# EAGLE schematic schematic (EAGLE 9.6.2)
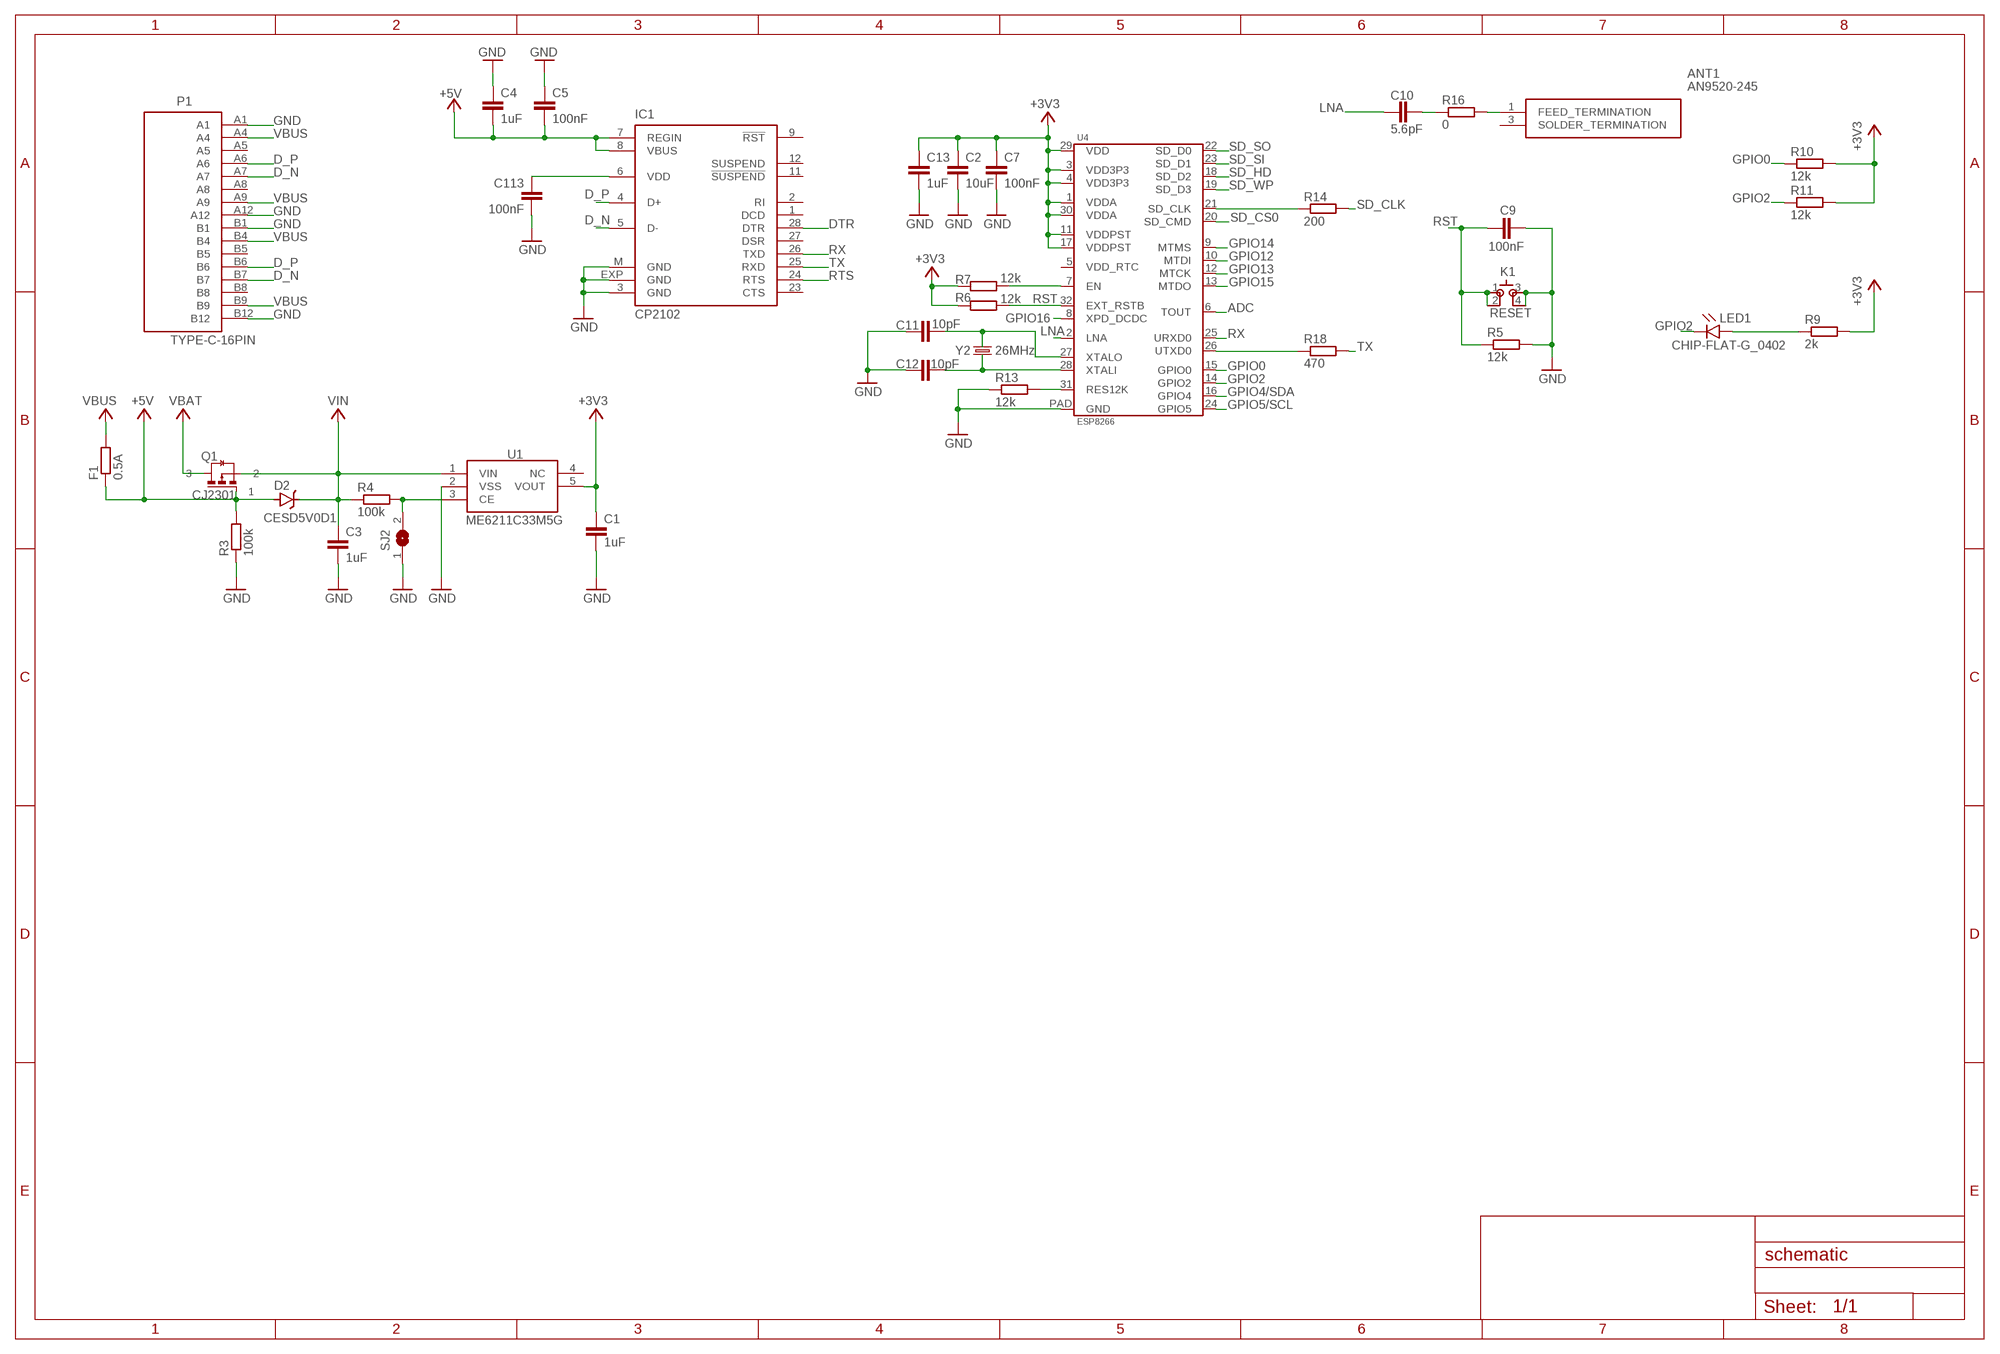
[diagram p0: schematic, sheet 1]

## Parts
ANT1  AN9520-245  [AN9520245]
C1  1uF  C-EUC0402  [C0402]
C2  10uF  C-EUC0402  [C0402]
C3  1uF  C-EUC0402  [C0402]
C4  1uF  C-EUC0402  [C0402]
C5  100nF  C-EUC0402  [C0402]
C7  100nF  C-EUC0402  [C0402]
C9  100nF  C-EUC0402  [C0402]
C10  5.6pF  C-EUC0402  [C0402]
C11  10pF  C-EUC0402  [C0402]
C12  10pF  C-EUC0402  [C0402]
C13  1uF  C-EUC0402  [C0402]
C113  100nF  C-EUC0402  [C0402]
D2  CESD5V0D1  [SOD-123]
F1  0.5A  R-EU_R0402  [R0402]
IC1  CP2102  [MLP28]
K1  RESET  SKSCLDE010  [SKSCLDE010]
LED1  CHIP-FLAT-G_0402  [LEDC1005X25N_FLAT-G]
P1  TYPE-C-16PIN  [TYPE-C-16PIN]
Q1  CJ2301  [SOT95P240X115-3N]
R3  100k  R-EU_R0402  [R0402]
R4  100k  R-EU_R0402  [R0402]
R5  12k  R-EU_R0402  [R0402]
R6  12k  R-EU_R0402  [R0402]
R7  12k  R-EU_R0402  [R0402]
R9  2k  R-EU_R0402  [R0402]
R10  12k  R-EU_R0402  [R0402]
R11  12k  R-EU_R0402  [R0402]
R13  12k  R-EU_R0402  [R0402]
R14  200  R-EU_R0402  [R0402]
R16  0  R-EU_R0603  [R0603]
R18  470  R-EU_R0402  [R0402]
SJ2  SJ  [SJ]
U1  ME6211C33M5G  [SOT95P282X145-5N]
U4  ESP8266  [ESP8266]
Y2  26MHz  YSX321SL  [SMD-3225-4]

## Nets
+3V3: C1.1 C2.1 C7.1 C13.1 R6.1 R7.1 R9.2 R10.2 R11.2 U1.5(VOUT) U4.1(VDDA) U4.3(VDD3P3) U4.4(VDD3P3) U4.11(VDDPST) U4.17(VDDPST) U4.29(VDD) U4.30(VDDA)
+5V: C4.2 C5.2 D2.A F1.1 IC1.7(REGIN) IC1.8(VBUS) Q1.1 R3.2
ADC: U4.6(TOUT)
D_N: IC1.5(D-) P1.A7 P1.B7
D_P: IC1.4(D+) P1.A6 P1.B6
DTR: IC1.28(DTR)
EN: R4.2 SJ2.2 U1.3(CE)
GND: C1.2 C2.2 C3.2 C4.1 C5.1 C7.2 C9.2 C11.1 C12.1 C13.2 C113.2 IC1.3(GND) IC1.EXP(GND) IC1.M(GND) K1.3 K1.4 P1.A1 P1.A12 P1.B1 P1.B12 R3.1 R5.2 R13.1 SJ2.1 U1.2(VSS) U4.PAD(GND)
GPIO0: R10.1 U4.15(GPIO0)
GPIO2: LED1.C R11.1 U4.14(GPIO2)
GPIO4/SDA: U4.16(GPIO4)
GPIO5/SCL: U4.24(GPIO5)
GPIO12: U4.10(MTDI)
GPIO13: U4.12(MTCK)
GPIO14: U4.9(MTMS)
GPIO15: U4.13(MTDO)
GPIO16: U4.8(XPD_DCDC)
LNA: C10.1 U4.2(LNA)
N$1: C113.1 IC1.6(VDD)
N$2: C12.2 U4.28(XTALI) Y2.3
N$3: C11.2 U4.27(XTALO) Y2.1
N$4: R13.2 U4.31(RES12K)
N$5: R7.2 U4.7(EN)
N$7: C10.2 R16.1
N$8: R14.1 U4.21(SD_CLK)
N$9: R18.1 U4.26(UTXD0)
N$10: ANT1.1(FEED_TERMINATION) R16.2
N$11: LED1.A R9.1
RST: C9.1 K1.1 K1.2 R5.1 R6.2 U4.32(EXT_RSTB)
RTS: IC1.24(RTS)
RX: IC1.26(TXD) U4.25(URXD0)
SD_CLK: R14.2
SD_CS0: U4.20(SD_CMD)
SD_HD: U4.18(SD_D2)
SD_SI: U4.23(SD_D1)
SD_SO: U4.22(SD_D0)
SD_WP: U4.19(SD_D3)
TX: IC1.25(RXD) R18.2
VBAT: Q1.3
VBUS: F1.2 P1.A4 P1.A9 P1.B4 P1.B9
VIN: C3.1 D2.C Q1.2 R4.1 U1.1(VIN)
Unconnected: ANT1.3(SOLDER_TERMINATION) IC1.1(DCD) IC1.2(RI) IC1.9(!RST) IC1.11(!SUSPEND) IC1.12(SUSPEND) IC1.23(CTS) IC1.27(DSR) P1.A5 P1.A8 P1.B5 P1.B8 U1.4(NC) U4.5(VDD_RTC)

## Library data of the parts
ANT1 = antenna:AN9520-245: SMD Antennas RoHS Source: Datasheet <https://datasheet.lcsc.com/szlcsc/1810251713_Rainsun-microwave-Tech-AN9520-245_C99665.pdf>; DESCRIPTION: SMD Antennas RoHS; HEIGHT: 1.2mm; MANUFACTURER_NAME: Rainsun microwave Tech; MANUFACTURER_PART_NUMBER: AN9520-245
C1-C5 C7 C9-C13 C113 = rcl:C-EU: CAPACITOR, European symbol; SPICEPREFIX: C
D2 = Diodes:CESD5V0D1: SOD-123 Plastic-Encapsulate Diodes Uni-direction ESD Protection Diode Manufacturer's datasheet <https://seeeddoc.github.io/Open_parts_library/res/304060001.pdf>; CREATED_BY: PCBLayout.com; MANUFACTURER: JCET; MPN: CESD5V0D1; PACKAGE: SOD-123
F1 R3-R7 R9-R11 R13 R14 R16 R18 = rcl:R-EU_: RESISTOR, European symbol; SPICEPREFIX: R
IC1 = silabs:CP210*: Single-Chip USB to UART Bridge Source: www.silabs.com .. CP2101.pdf / cp2102.pdf; MF: FARNELL; MPN: CP2102-GM; OC_FARNELL: 9282130; OC_NEWARK: 30K5635
K1 = alps:SKSCLDE010
LED1 = LED:CHIP-FLAT-G; CATEGORY: LED; COLOR: GREEN; DESCRIPTION: CHIP LED FLAT; SUB-CATEGORY: CHIP; TYPE: FLAT_TOP
P1 = usb:TYPE-C-16PIN
Q1 = library:CJ2301
SJ2 = jumper:SJ: SMD solder JUMPER
U1 = library:ME6211C33M5G: High Speed LDO Regulators, High PSRR, Low noise, ME6211 Series Source: Datasheet <http://xinhuidianzi.com.cn/UploadSysFiles/files/LDO-series/ME6211-Series_E15.0.pdf>; DESCRIPTION: High Speed LDO Regulators, High PSRR, Low noise, ME6211 Series; HEIGHT: 1.45mm; MANUFACTURER_NAME: Microne; MANUFACTURER_PART_NUMBER: ME6211C33M5G
U4 = Espressif:ESP8266
Y2 = crystal:YSX321SL; SPICEPREFIX: B